# Altium schematic sheet 06_LEDs.SchDoc
size A
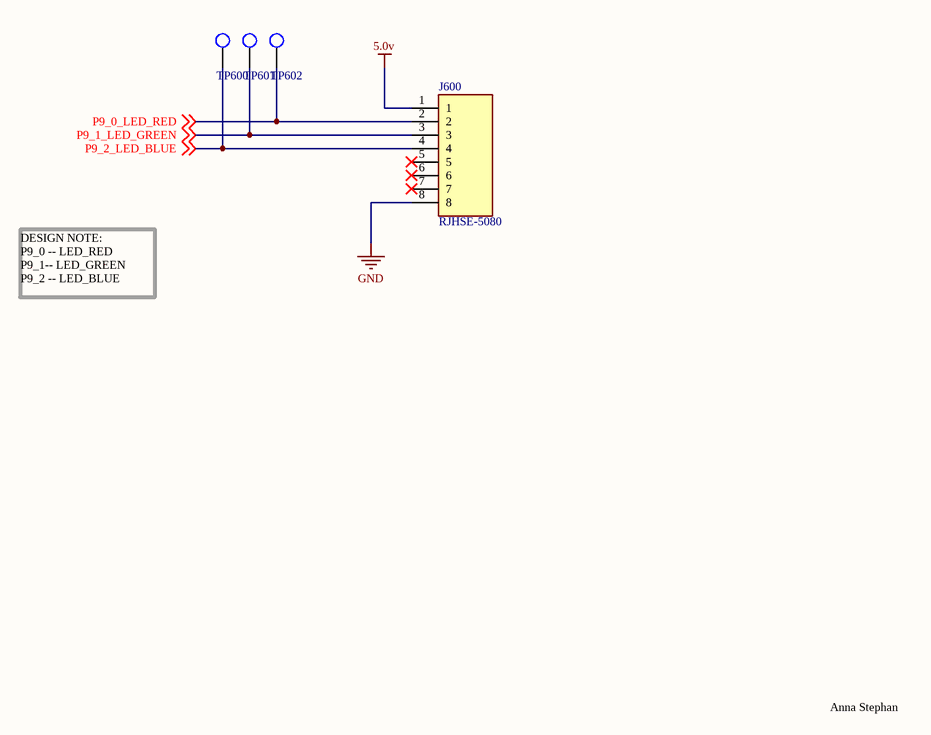
[diagram p0: 06_LEDs.SchDoc]

## Parts
J600  RJHSE-5080  [CONN_RJSBE5080_16P13X12P57_AMP]
TP600  TP_1206  [TP-SMC-1206]  (value not drawn)
TP601  TP_1206  [TP-SMC-1206]  (value not drawn)
TP602  TP_1206  [TP-SMC-1206]  (value not drawn)

## Nets
5.0v: J600.1
GND: J600.8
P9_0_LED_RED: J600.2 TP602.1 ; off-sheet P9_0_LED_RED
P9_1_LED_GREEN: J600.3 TP601.1 ; off-sheet P9_1_LED_GREEN
P9_2_LED_BLUE: J600.4 TP600.1 ; off-sheet P9_2_LED_BLUE

Not connected (* = marked no-connect by the designer): J600 5* 6* 7*

## Notes on the sheet
- DESIGN NOTE:
  P9_0 -- LED_RED
  P9_1-- LED_GREEN
  P9_2 -- LED_BLUE
- Anna Stephan

## Library data of the parts
J600 = RJHSE-5080: Jack Modular Connector 8p8c (RJ45, Ethernet) 90Â° Angle (Right) Unshielded; Manufacturer: Amphenol CS (Commercial Products); MF: Amphenol Commercial Products; MP: RJHSE-5080; SnapEDA_Link: https://www.snapeda.com/parts/RJHSE-5080/Amphenol/view-part/4796273/?ref=snap; Package: None; Value: *; Digi-Key_Part_Number: RJHSE-5080-ND; Manufacturer Part No.: RJHSE-5080; Digikey Part No.: RJHSE-5080-ND
TP600-TP602 = TP_1206: Test Point SMD 1206; Manufacturer: TE Connectivity (Tyco Electronics); Manufacturer Part Number: 1625854-1; Resistance Value: 0 Ohm; Temperature Coefficient: N/R; Supplier: Digi-Key; Stock 1: 31937; Pricing 1: 1=0.28, 10=0.261, 25=0.224, 50=0.1902, 100=0.1828, 250=0.1641, 500=0.1567, 1000=0.1306 (USD); Case Size: 1206; Dimension: 3.2 x 1.6 x 1.25mm; Family: RC; Mounting: Surface Mount; Operating Temperature: -55 to 125 C; Part No: 1625854-1; RoHS: Yes; Packaging: Tape and Reel; Termination Style: N/R; Terminal Pitch: N/R; Power Rating: N/R; Tolerance: N/R; ComponentLink1URL: https://datasheet.ciiva.com/6439/eng-ds-1773266-a-6439169.pdf; ComponentLink1Description: https://datasheet.ciiva.com/6439/eng-ds-1773266-a-6439169.pdf; ComponentLink2URL: https://datasheet.ciiva.com/30136/1773266-a-30136341.pdf; ComponentLink2Description: https://datasheet.ciiva.com/30136/1773266-a-30136341.pdf; ComponentLink3URL: https://datasheet.ciiva.com/6439/eng-ds-1773266-a-6439080.pdf; ComponentLink3Description: https://datasheet.ciiva.com/6439/eng-ds-1773266-a-6439080.pdf; ComponentLink4URL: https://datasheet.ciiva.com/6439/eng-ds-1773266-a-6439081.pdf; ComponentLink4Description: https://datasheet.ciiva.com/6439/eng-ds-1773266-a-6439081.pdf; ComponentLink5URL: https://datasheet.ciiva.com/6439/eng-ds-1773266-a-6439083.pdf; ComponentLink5Description: https://datasheet.ciiva.com/6439/eng-ds-1773266-a-6439083.pdf; Supplier Part Number: A106143CT-ND